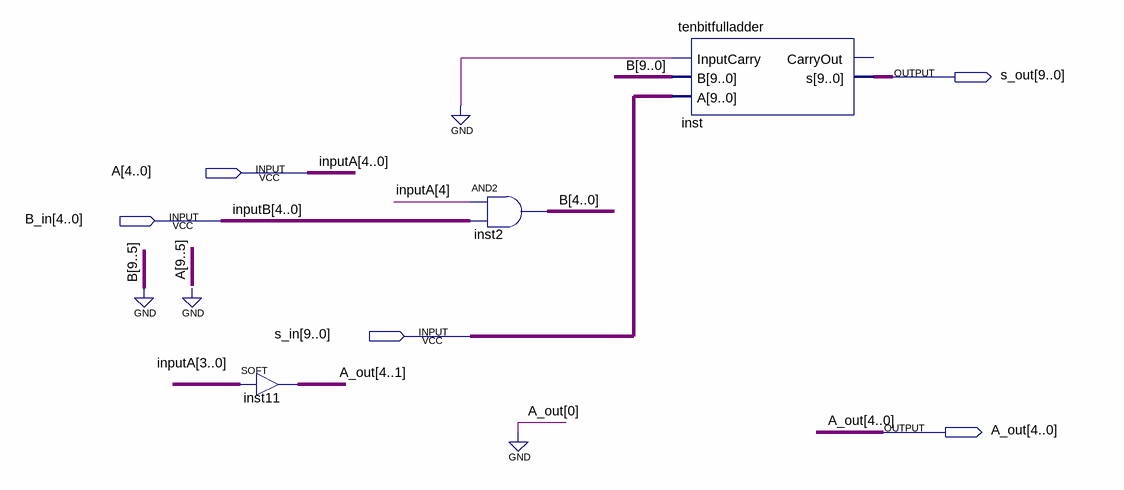
[diagram p0: schematic sheet]
// Quartus schematic lastsum.bdf as structural Verilog: 3 symbols, 5 pins
module lastsum (
  input  [4:0] A,
  input  [4:0] B_in,
  input  [9:0] s_in,
  output [9:0] s_out,
  output [4:0] A_out
);

  wire [4:0] B;

  SOFT inst11[3:0] (.IN(A[3:0]), .OUT(A_out[4:1]));
  assign B = {5{A[4]}} & B_in;  // AND2 inst2, 5 bits wide
  tenbitfulladder inst (.InputCarry(1'b0), .B({{5{1'b0}}, B}), .A(s_in), .s(s_out));  // open: CarryOut

  assign A_out[0] = 1'b0;

  // Other names for the same wires on the sheet: inputA[4:0] = A; inputB[4:0] = B_in
endmodule
